# EAGLE design DC-PSx (EAGLE 9.6.2)
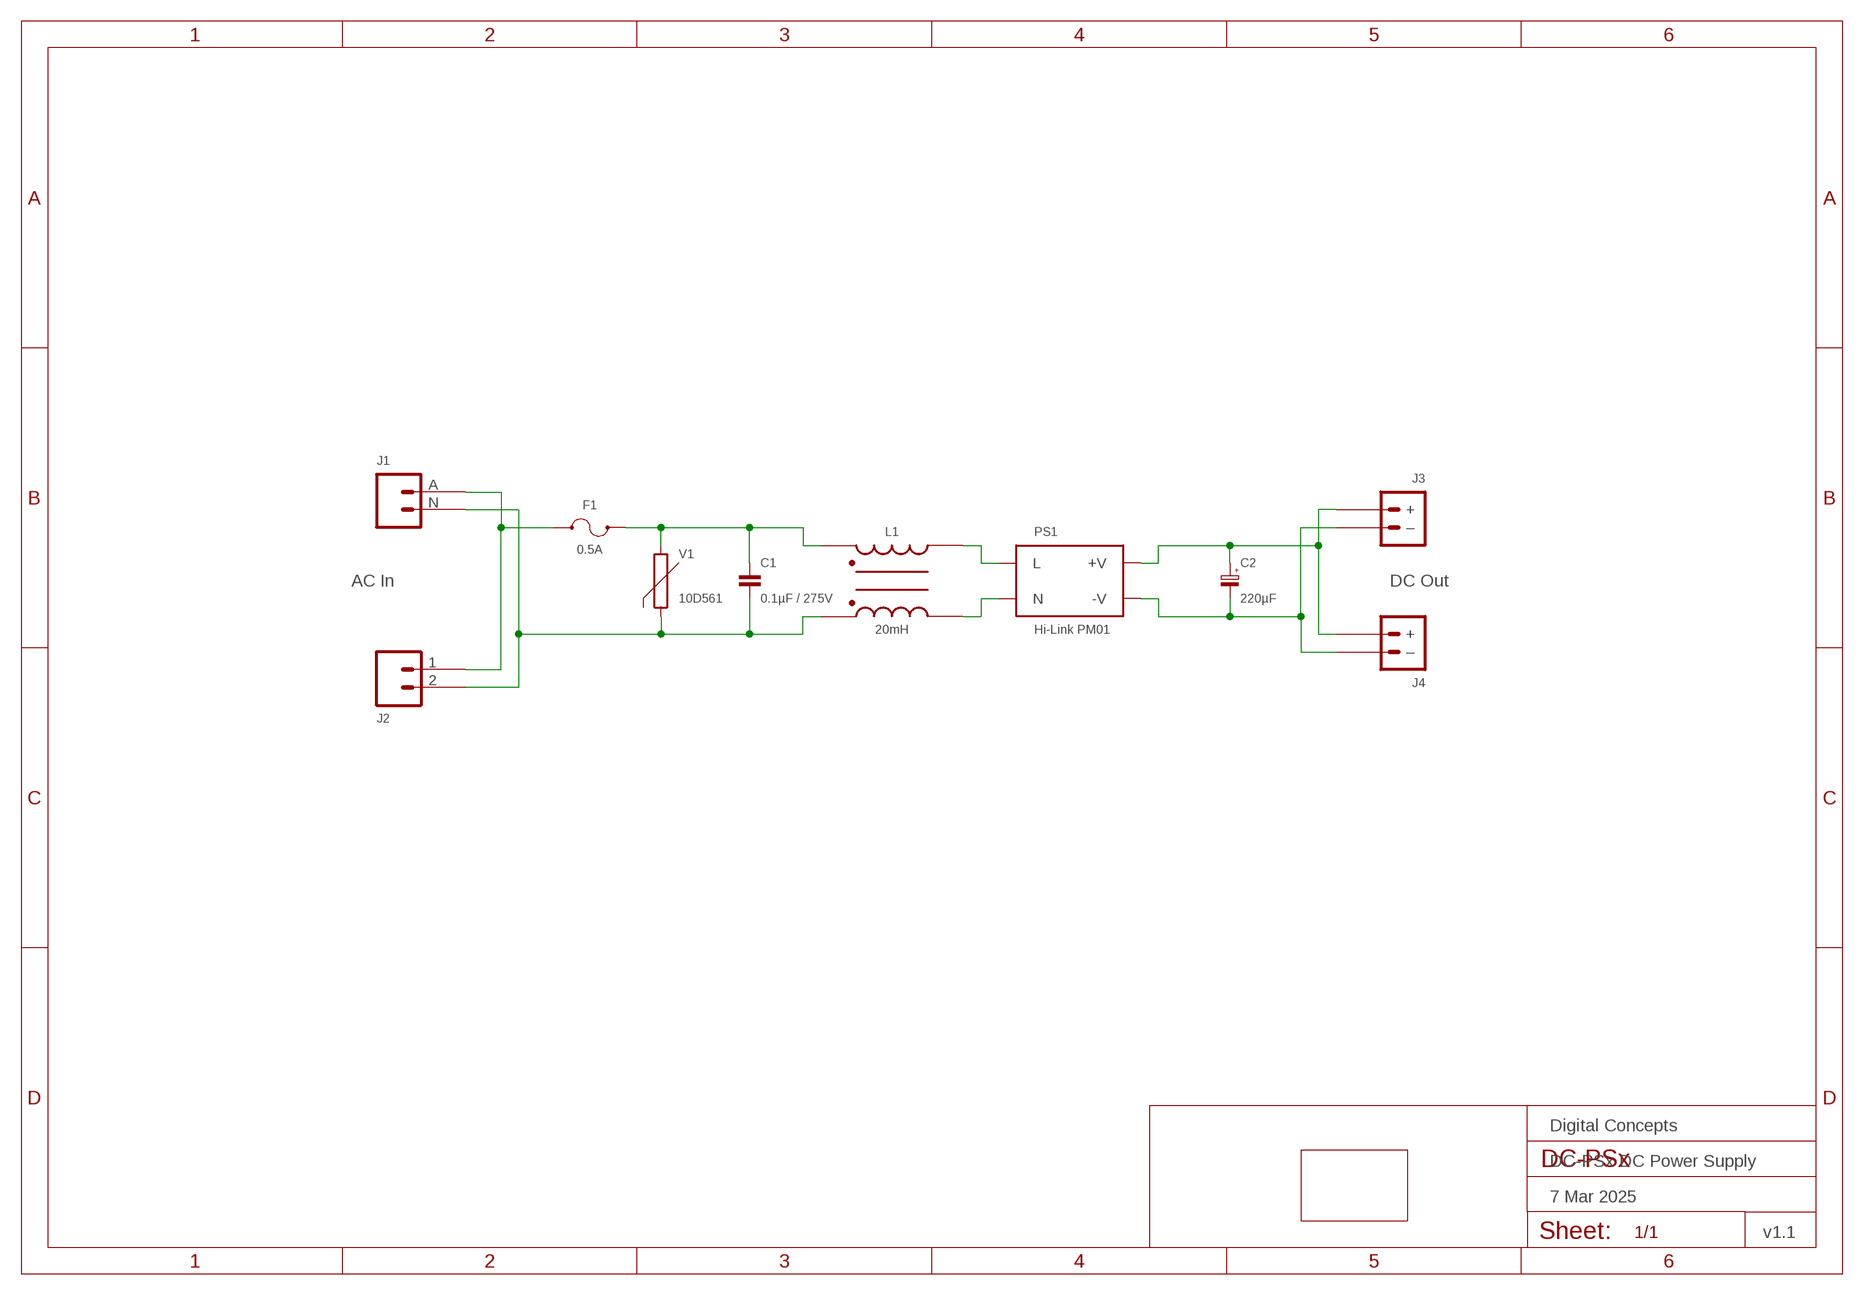
[diagram p0: schematic, sheet 1]
FRAME2 (FRAME-A4L-LOC): DATE: 7 Mar 2025; OWNER: Digital Concepts; TITLE: DC-PSx DC Power Supply; VERSION: v1.1

## Parts
C1  0.1µF / 275V  CAPACITOR-TENTA-SUPPRESSION  [CAPACITOR-TENTA-SUPPRESSION]
C2  220µF  CAPACITOR-ELECTROLYTICE5-10.5  [E5-10,5]
F1  0.5A  FUSE-HOLDER-1808  [FUSE-HOLDER-1808]
J1  AC In  AC_POWER_SOCKET_DB-03  [DB-03_AC_POWER_SOCKET]
J2  TERMINAL_SCREW_2P_VERTICAL  [TERMINAL-SCREW-2P]
J3  DC Out  JST-PH2.0-2-VERTICAL-POWER  [JST-PH2.0-2-VERTICAL-POWER]
J4  TERMINAL_SCREW_2P_POWER  [TERMINAL-SCREW-2P]
L1  20mH  INDUCTOR-COMMON-MODE-UU9.8  [INDUCTOR-UU9.8]
PCB1  PCB-OUTLINE-64X36  [PCB-POWER-SUPPLY-3]
PS1  Hi-Link PM01  POWER_SUPPLY-HI-LINK  [HI-LINK_PM0X]
V1  10D561  VARISTOR-10D561  [VARISTOR-10D561]

## Nets
N$1: F1.P$1 J1.A J2.1
N$2: C1.P$1 F1.P$2 L1.P$1 V1.2
N$3: L1.P$2 PS1.AC-L(L)
N$4: C1.P$2 J1.N J2.2 L1.P$4 V1.1
N$5: L1.P$3 PS1.AC-N(N)
N$6: C2.+ J3.+ J4.2(+) PS1.+VO(+V)
N$7: C2.- J3.-(–) J4.1(–) PS1.-VO(-V)

## Library data of the parts
C1 = digitalconcepts:CAPACITOR-TENTA-SUPPRESSION: MEX/TENTA Interference Suppression Capacitor
C2 = digitalconcepts:CAPACITOR-ELECTROLYTIC: Electrolytic Capacitor; SPICEPREFIX: C
F1 = digitalconcepts:FUSE-HOLDER-1808: 1808 Fuse Holder
J1 = digitalconcepts:AC_POWER_SOCKET_DB-03: DB-03 AC Power Socket
J2 = digitalconcepts:TERMINAL_SCREW_2P_VERTICAL: PCB Mount Screw-Type Terminal 2P
J3 = digitalconcepts:JST-PH2.0-2-VERTICAL-POWER: JST PH2.0 2P PTH Connector (Power)
J4 = digitalconcepts:TERMINAL_SCREW_2P_POWER: PCB Mount Screw-Type Terminal 2P
L1 = digitalconcepts:INDUCTOR-COMMON-MODE-UU9.8: UU9.8 Common Mode Inductor
PCB1 = digitalconcepts:PCB-OUTLINE-64X36: Power Supply PCB Outline (64 x 36)
PS1 = digitalconcepts:POWER_SUPPLY-HI-LINK: Hi-Link Power Supply Module
V1 = digitalconcepts:VARISTOR-10D561: VARISTOR

## Board
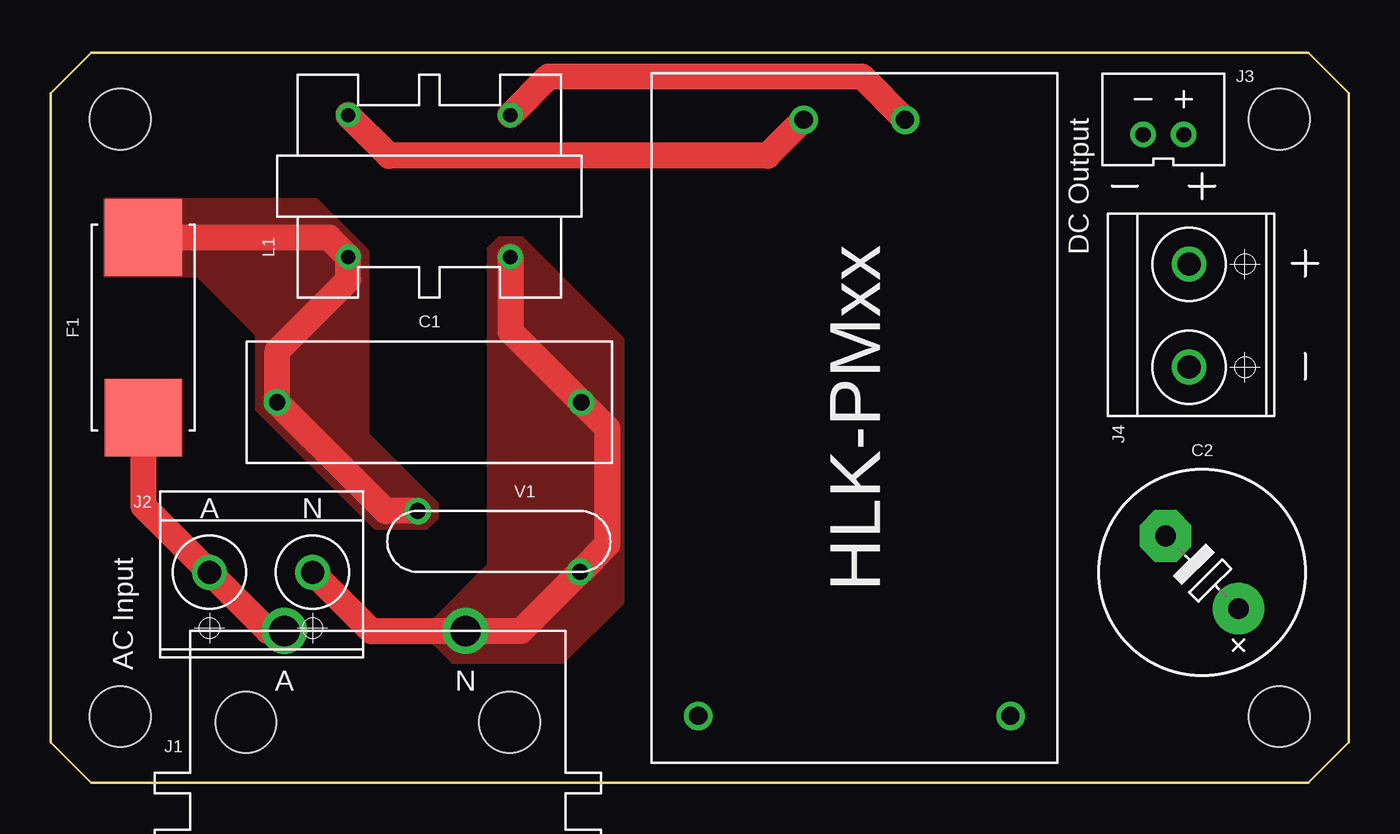
[diagram p1: board, top side]
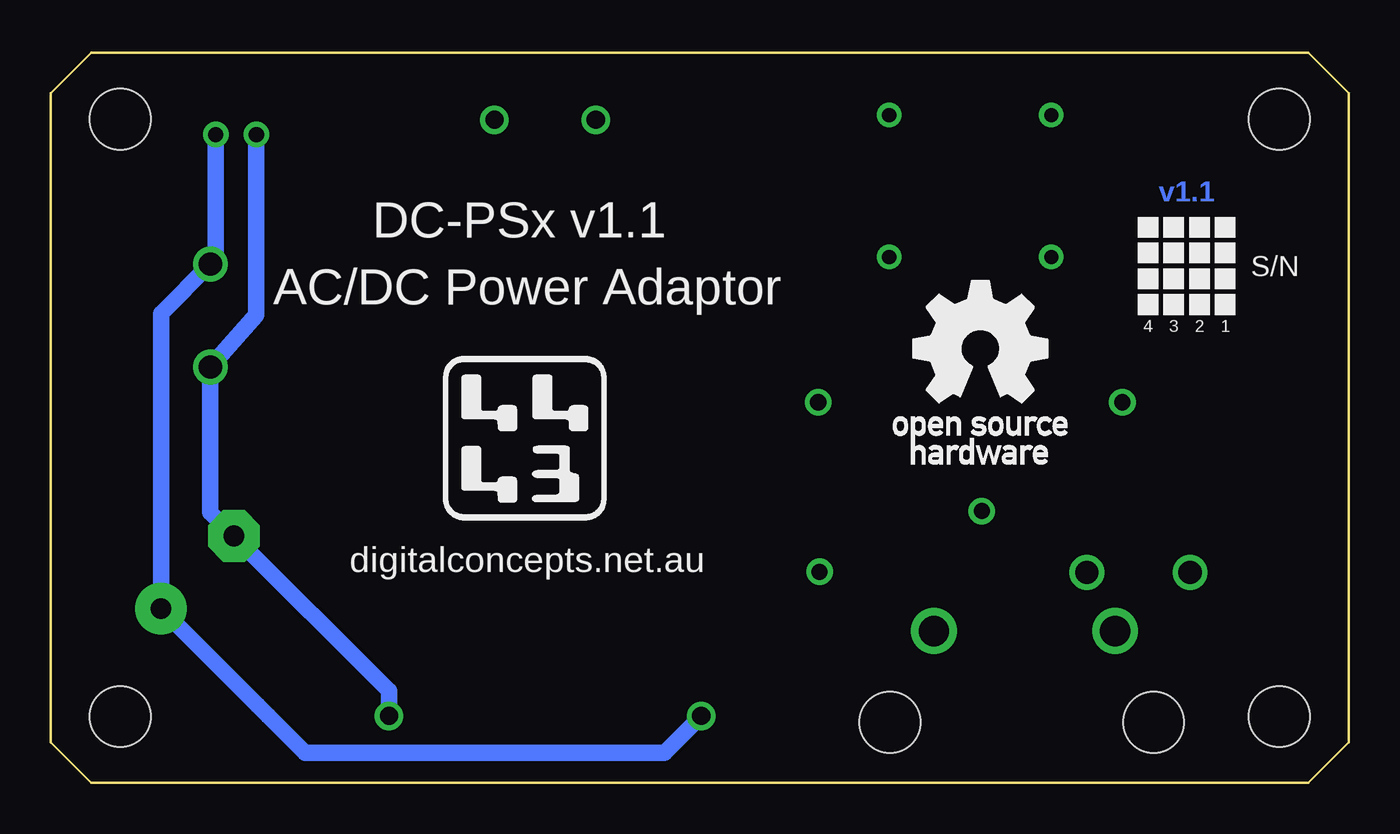
[diagram p2: board, bottom side, seen from below]

Size 64 x 36 mm. Coordinates in mm from the lower left corner, seen from the top.
Copper layers (1*16): Top 0.035mm / dielectric 1.5mm / Bottom 0.035mm
Design rules "default *": minimum track width 6mil, minimum drill 0.35mm, track to track 6mil, track to pad 6mil, pad to pad 6mil, via to via 6mil, smd to smd 6mil, copper to edge 6mil, drill to drill 6mil, minimum pad ring 10mil, minimum via ring 8mil, stop-mask expansion 4mil, vias tented up to drill 0mil, thermal gap 10mil

### Footprints (pad centres in the part's own frame; a part is rotated, then mirrored left to right if it is on the bottom)
CAPACITOR-TENTA-SUPPRESSION = drill 0.8: P$1 -7.5,0; P$2 7.5,0
E5-10,5 = drill 1.016 pad 2.54: + -2.54,0 | drill 1.016 pad 2.54 octagon: - 2.54,0
FUSE-HOLDER-1808 = smd 3.81 x 3.81: P$1 -4.445,0; P$2 4.445,0
DB-03_AC_POWER_SOCKET = drill 1.5: A 4.6,-6; N -4.33,-6 | hole 3: -6.5,-1.5; 6.5,-1.5
TERMINAL-SCREW-2P = drill 1.143: 1 -2.58,0; 2 2.5,0
JST-PH2.0-2-VERTICAL-POWER = drill 0.75: + -1,0; - 1,0
INDUCTOR-UU9.8 = drill 0.7: P$1 -3.5,4; P$2 3.5,4; P$3 3.5,-4; P$4 -3.5,-4
PCB-POWER-SUPPLY-3 = hole 3: -28.575,14.732; -28.575,-14.732; 28.575,-14.732; 28.575,14.732
HI-LINK_PM0X = drill 0.9: +VO 14.7,-7.7; -VO 14.7,7.7; AC-L -14.7,-2.5; AC-N -14.7,2.5
VARISTOR-10D561 = drill 0.8: 1 -4,1.5; 2 4,-1.5

### Placement (x,y rotation side)
C1  18.66,18.76 0 top
C2  56.77,10.38 135 top
F1  4.57,22.45 90 top
J1  16.12,1.49 180 top
J2  10.41,10.38 0 top
J3  54.86,31.97 180 top
J4  56.13,23.08 90 top
L1  18.66,29.43 90 top
PCB1  32,18 0 top
PS1  39.62,18 270 top
V1  22.09,11.9 180 top

### Tracks (layer width: path | path; a pad name or v marks a point on that pad's centre or on a via)
N$1
  Top 1.27: 5.29,18 F1.P$1 4.57,13.64 J2.1 10.72,7.49 J1.A
N$2
  Top 1.27: V1.2 16.52,13.4 C1.P$1 11.16,21.3 14.66,24.8 L1.P$1 13.7,26.89 F1.P$2
  pour Top (no thermals): 2.66,28.8 13.08,28.8 15.62,26.26 15.62,17.24 19.05,13.81 19.05,13.05 18.54,12.54 16,12.54 10.16,18.38 10.16,22.06 7.23,24.98 2.66,24.98
N$3
  Top 1.27: L1.P$2 16.67,30.92 35.34,30.92 PS1.AC-L
N$4
  Top 1.27: L1.P$4 22.66,22.26 C1.P$2 27.43,17.49 27.43,11.75 V1.1 23.18,7.49 J1.N 15.8,7.49 J2.2
  pour Top (no thermals): 22.09,26.89 23.24,26.89 28.19,21.94 28.19,8.86 25.27,5.94 19.81,5.94 18.92,6.82 18.92,8.09 21.59,10.76 21.59,26.38
N$5
  Top 1.27: L1.P$3 24.57,34.84 39.98,34.84 PS1.AC-N
N$6
  Bottom 0.813: J3.+ 55.86,25.85 J4.2 58.56,23.15 C2.+ 53.8,3.82 53.28,3.3 51.47,1.49 33.73,1.49 PS1.+VO
N$7
  Bottom 0.813: J3.- 53.86,23.08 J4.1 56.13,13.34 C2.- 47.32,4.53 PS1.-VO

### Text on the board
Bottom: v1.1
tPlace: A | N | A | N
bPlace: DC-PSx v1.1 | S/N | AC/DC Power Adaptor | 1 | 2 | 3 | 4 | digitalconcepts.net.au
tNames: DC Output | AC Input